# Altium project Bus_Adaptor_Hw.PrjPcb
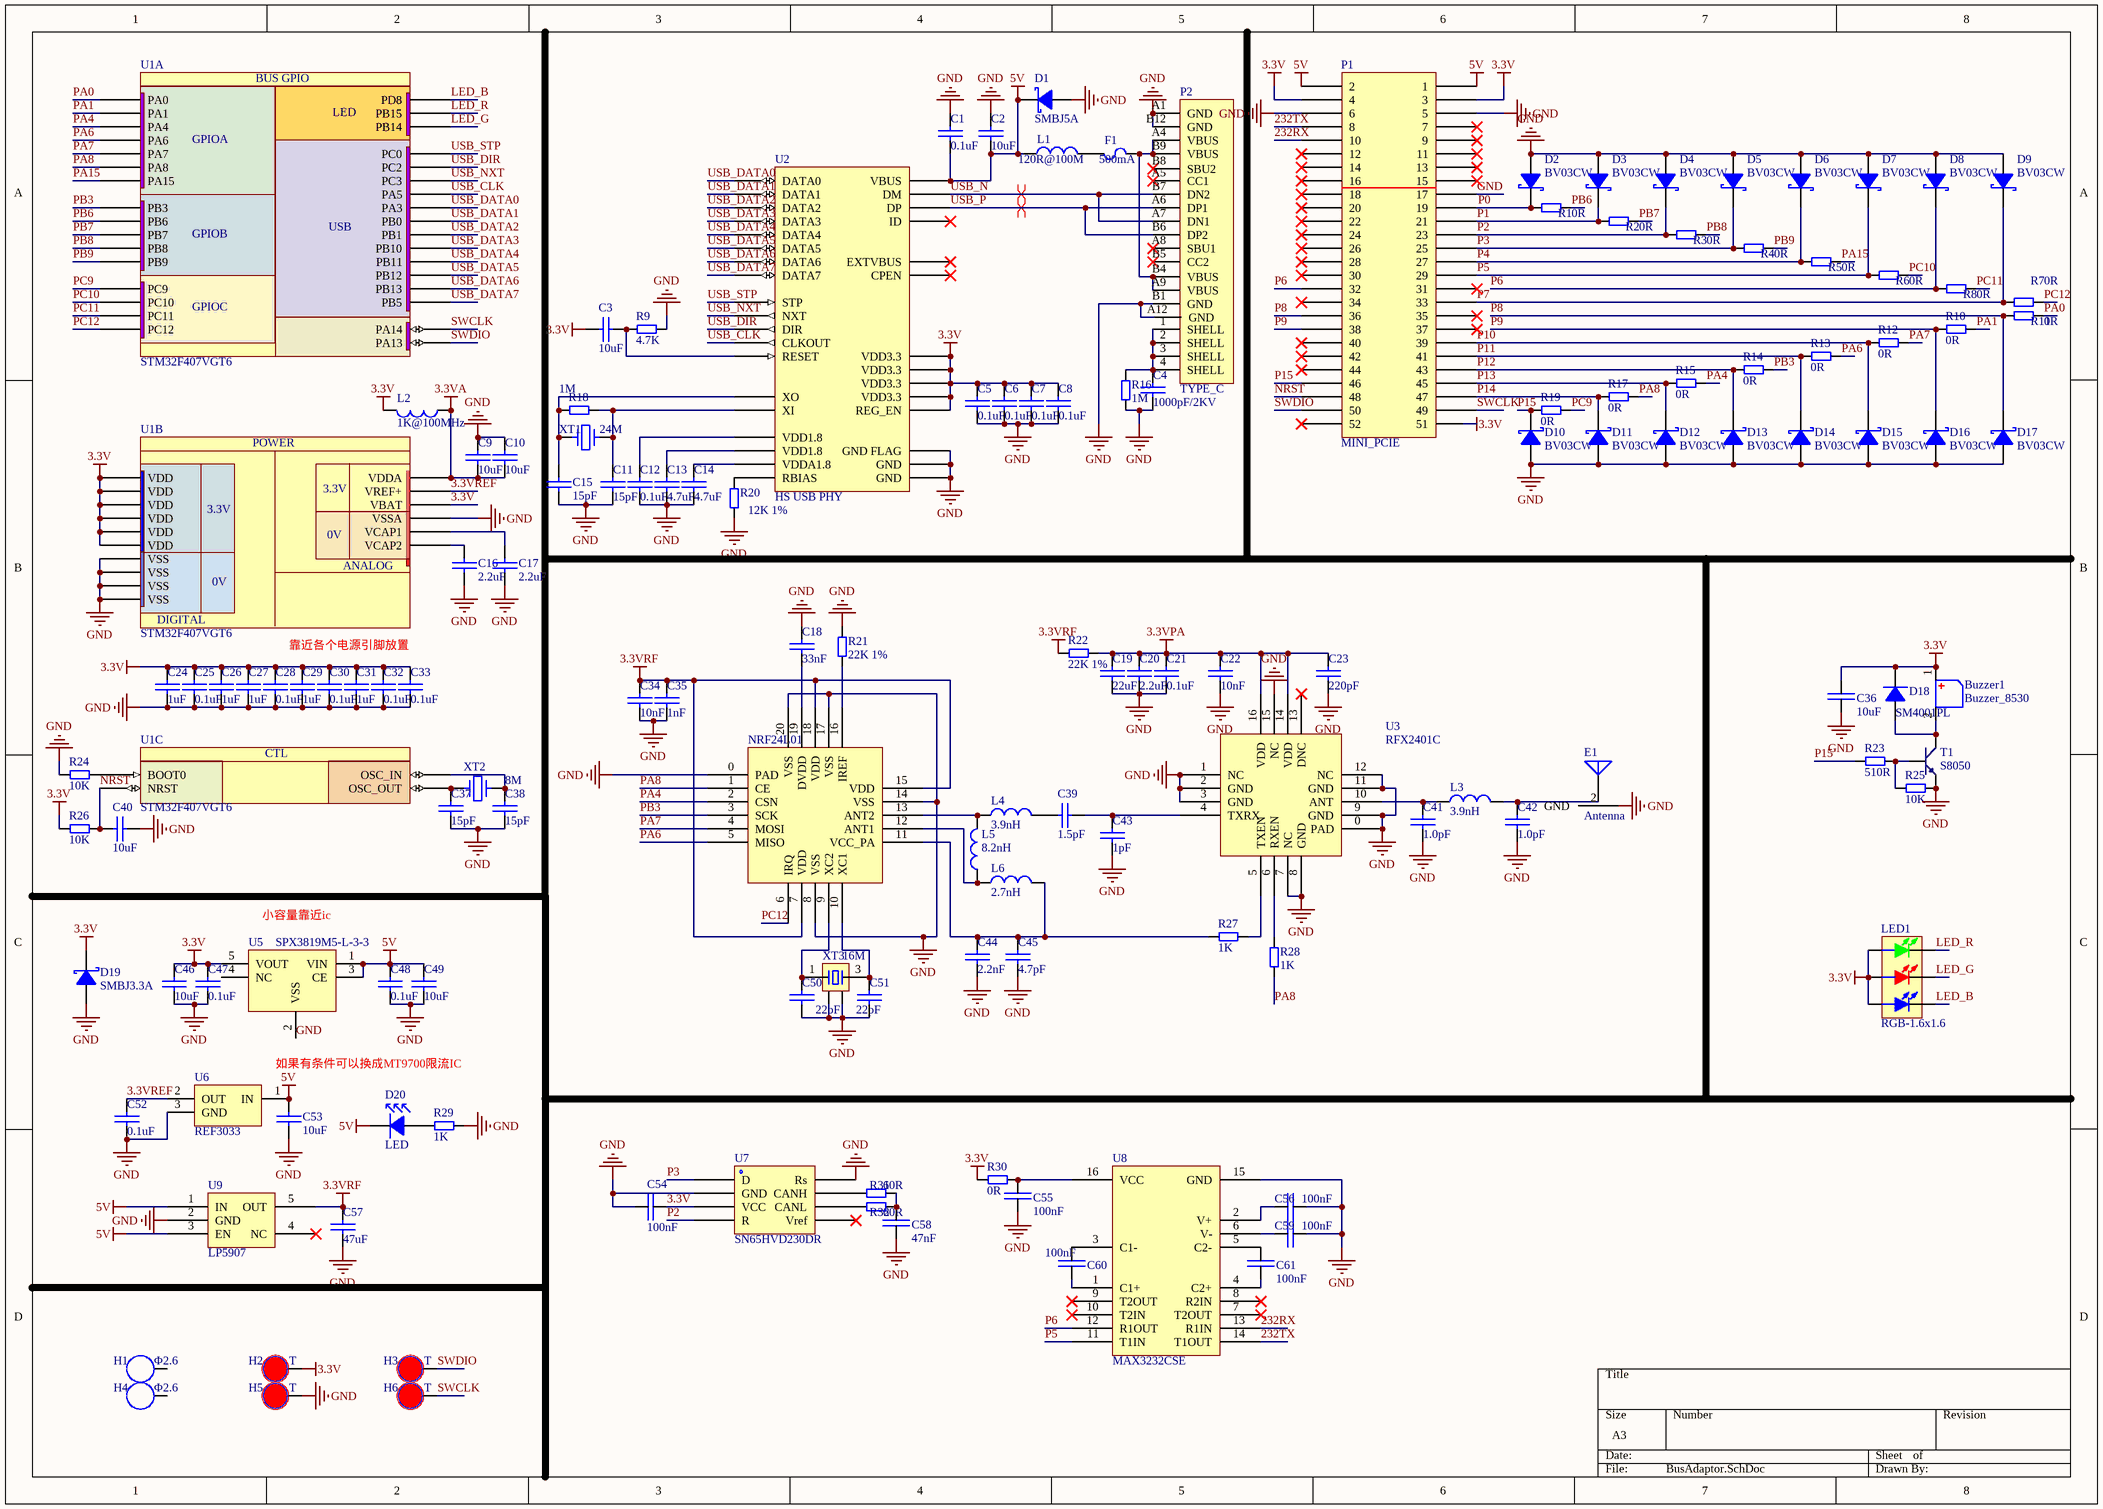
[diagram p0: BusAdaptor.SchDoc]
1 sheet, 144 parts. Net scope: global (net labels, ports and power ports of the same name join across sheets).
Board file: BusAdaptor_final.PcbDoc

## Sheet BusAdaptor.SchDoc
size A3

### Parts
Buzzer1  Buzzer_8530  [BUZZER_8530]
C1  0.1uF  [0201]
C2  10uF  [0402_C]
C3  10uF  [0402_C]
C4  1000pF/2KV  [1206_C]
C5  0.1uF  [0201]
C6  0.1uF  [0201]
C7  0.1uF  [0201]
C8  0.1uF  [0201]
C9  10uF  [0402_C]
C10  10uF  [0402_C]
C11  15pF  [0201]
C12  0.1uF  [0201]
C13  4.7uF  [0402_C]
C14  4.7uF  [0402_C]
C15  15pF  [0201]
C16  2.2uF  [0402_C]
C17  2.2uF  [0402_C]
C18  33nF  [0402_C]
C19  22uF  [0603_C]
C20  2.2uF  [0402_C]
C21  0.1uF  [0402_C]
C22  10nF  [0402_C]
C23  220pF  [0402_C]
C24  1uF  [0201]
C25  0.1uF  [0201]
C26  1uF  [0201]
C27  1uF  [0201]
C28  0.1uF  [0201]
C29  1uF  [0201]
C30  0.1uF  [0201]
C31  1uF  [0201]
C32  0.1uF  [0201]
C33  0.1uF  [0201]
C34  10nF  [0402_C]
C35  1nF  [0402_C]
C36  10uF  [0402_C]
C37  15pF  [0402_C]
C38  15pF  [0402_C]
C39  1.5pF  [0402_C]
C40  10uF  [0402_C]
C41  1.0pF  [0402_C]
C42  1.0pF  [0402_C]
C43  1pF  [0402_C]
C44  2.2nF  [0402_C]
C45  4.7pF  [0402_C]
C46  10uF  [0402_C]
C47  0.1uF  [0402_C]
C48  0.1uF  [0402_C]
C49  10uF  [0402_C]
C50  22pF  [0402_C]
C51  22pF  [0402_C]
C52  0.1uF  [0402_C]
C53  10uF  [0402_C]
C54  100nF  [0402_C]
C55  100nF  [0201]
C56  100nF  [0201]
C57  47uF  [0805_C]
C58  47nF  [0402_C]
C59  100nF  [0201]
C60  100nF  [0201]
C61  100nF  [0201]
D1  SMBJ5A  [SMB]
D2  BV03CW  [SOD323]
D3  BV03CW  [SOD323]
D4  BV03CW  [SOD323]
D5  BV03CW  [SOD323]
D6  BV03CW  [SOD323]
D7  BV03CW  [SOD323]
D8  BV03CW  [SOD323]
D9  BV03CW  [SOD323]
D10  BV03CW  [SOD323]
D11  BV03CW  [SOD323]
D12  BV03CW  [SOD323]
D13  BV03CW  [SOD323]
D14  BV03CW  [SOD323]
D15  BV03CW  [SOD323]
D16  BV03CW  [SOD323]
D17  BV03CW  [SOD323]
D18  SM4001PL  [SOD-123FL]
D19  SMBJ3.3A  [SMB]
D20  LED  [0603_L]
E1  Antenna  [IPEX]
F1  500mA  [0805_R]
H1  Φ2.6  [HOLD]
H2  T  [testpoint]
H3  T  [testpoint]
H4  Φ2.6  [HOLD]
H5  T  [testpoint]
H6  T  [testpoint]
L1  120R@100M  [0603_L]
L2  1K@100MHz  [0603_L]
L3  3.9nH  [0402_L]
L4  3.9nH  [0402_L]
L5  8.2nH  [0402_L]
L6  2.7nH  [0402_L]
LED1  RGB-1.6x1.6  [RGB-1.6x1.6]
NRF24L01  NRF24L01  [QFN-20_4x4x05P]  (value not drawn)
P1  MINI_PCIE  [MINIPCIE]
P2  TYPE_C  [TYPE-C-TOP]
R1  0R  [0402_R]
R2  0R  [0402_R]
R3  0R  [0402_R]
R4  0R  [0402_R]
R5  0R  [0402_R]
R6  0R  [0402_R]
R7  0R  [0402_R]
R8  0R  [0402_R]
R9  4.7K  [0402_R]
R10  0R  [0402_R]
R11  0R  [0402_R]
R12  0R  [0402_R]
R13  0R  [0402_R]
R14  0R  [0402_R]
R15  0R  [0402_R]
R16  1M  [0201]
R17  0R  [0402_R]
R18  1M  [0201]
R19  0R  [0402_R]
R20  12K 1%  [0402_R]
R21  22K 1%  [0402_R]
R22  22K 1%  [0402_R]
R23  510R  [0402_R]
R24  10K  [0402_R]
R25  10K  [0402_R]
R26  10K  [0402_R]
R27  1K  [0402_R]
R28  1K  [0402_R]
R29  1K  [0402_R]
R30  0R  [0201]
R31  60R  [0402_R]
R32  60R  [0402_R]
T1  S8050  [SOT-23(SOT-23-3)]
U1  STM32F407VGT6  [TQFP-100]  (parts A,B,C of 3)
U2  HS USB PHY  [QFN50P500X500X100-32N]
U3  RFX2401C  [RFX2401C]
U5  SPX3819M5-L-3-3  [SOT-23-5]
U6  REF3033  [SOT-23(SOT-23-3)]
U7  SN65HVD230DR
U8  MAX3232CSE  [SOIC-16_150mil]
U9  LP5907  [SOT-23-5]
XT1  24M  [CRYSTAL-SMD-5032]
XT2  8M  [CRYSTAL-SMD-5032]
XT3  16M  [OSC 3225-4P]

### Nets
3.3V: Buzzer1.1 C3.2 C5.2 C6.2 C7.2 C8.2 C24.2 C25.2 C26.2 C27.2 C28.2 C29.2 C30.2 C31.2 C32.2 C33.2 C36.2 C46.2 C47.2 C54.1 D18.2(K) D19.2(K) H2.1 L2.2 LED1.2(A) LED1.4(A) LED1.6(A) P1.3 P1.4 P1.51 R26.1 R30.2 U1.6(VBAT) U1.11(VDD) U1.19(VDD) U1.28(VDD) U1.50(VDD) U1.75(VDD) U1.100(VDD) U2.6(VDD3.3) U2.16(VDD3.3) U2.25(VDD3.3) U2.30(VDD3.3) U2.31(REG_EN) U5.5(VOUT) U7.3(VCC)
3.3VA: C9.1 C10.1 L2.1 U1.22(VDDA)
3.3VPA: C19.2 C20.2 C21.2 C22.2 C23.2 R22.1 U3.14(VDD) U3.16(VDD)
3.3VRF: C34.2 C35.2 C57.2 NRF24L01.7(VDD) NRF24L01.15(VDD) NRF24L01.18(VDD) R22.2 U9.5(OUT)
5V: C1.1 C2.1 C48.2 C49.2 C53.2 D1.2(K) D20.2(K) L1.1 P1.1 P1.2 U2.4(VBUS) U5.1(VIN) U5.3(CE) U6.1(IN) U9.1(IN) U9.3(EN)
GND: C1.2 C2.2 C4.1 C5.1 C6.1 C7.1 C8.1 C9.2 C10.2 C11.1 C12.1 C13.1 C14.1 C15.1 C16.1 C17.1 C18.2 C19.1 C20.1 C21.1 C22.1 C23.1 C24.1 C25.1 C26.1 C27.1 C28.1 C29.1 C30.1 C31.1 C32.1 C33.1 C34.1 C35.1 C36.1 C37.1 C38.1 C40.1 C41.1 C42.1 C43.1 C44.1 C45.1 C46.1 C47.1 C48.1 C49.1 C50.1 C51.1 C52.1 C53.1 C54.2 C55.2 C56.2 C57.1 C58.1 C59.2 D1.1(A) D2.1(A) D3.1(A) D4.1(A) D5.1(A) D6.1(A) D7.1(A) D8.1(A) D9.1(A) D10.1(A) D11.1(A) D12.1(A) D13.1(A) D14.1(A) D15.1(A) D16.1(A) D17.1(A) D19.1(A) E1.2(GND) H5.1 NRF24L01.0(PAD) NRF24L01.8(VSS) NRF24L01.14(VSS) NRF24L01.17(VSS) NRF24L01.20(VSS) P1.5 P1.6 P1.17 P2.A1(GND) P2.A12(GND) P2.B1(GND) P2.B12(GND) R9.2 R16.1 R20.1 R21.2 R24.1 R25.2 R29.1 T1.2(E) U1.10(VSS) U1.20(VSSA) U1.27(VSS) U1.74(VSS) U1.99(VSS) U2.0(GND_FLAG) U2.1(GND) U2.2(GND) U3.0(PAD) U3.1(NC) U3.2(GND) U3.3(GND) U3.7(NC) U3.8(GND) U3.9(GND) U3.11(GND) U3.12(NC) U3.15(NC) U5.2(VSS) U6.3(GND) U7.2(GND) U7.8(Rs) U8.15(GND) U9.2(GND) XT3.2 XT3.4
3.3VREF: C52.2 U1.21(VREF+) U6.2(OUT)
232RX: P1.10 U8.13(R1IN)
232TX: P1.8 U8.14(T1OUT)
LED_B: LED1.5(BULE_K) U1.55(PD8)
LED_G: LED1.3(RED_K) U1.53(PB14)
LED_R: LED1.1(GREEN_K) U1.54(PB15)
NRST: C40.2 P1.48 R26.2 U1.14(NRST)
P0: D2.2(K) P1.19 R1.1
P1: D3.2(K) P1.21 R2.1
P2: D4.2(K) P1.23 R3.1 U7.4(R)
P3: D5.2(K) P1.25 R4.1 U7.1(D)
P4: D6.2(K) P1.27 R5.1
P5: D7.2(K) P1.29 R6.1 U8.11(T1IN)
P6: D8.2(K) P1.32 R8.1 U8.12(R1OUT)
P7: D9.2(K) P1.33 R7.1
P8: D17.2(K) P1.36 R11.1
P9: D16.2(K) P1.38 R10.1
P10: D15.2(K) P1.39 R12.1
P11: D14.2(K) P1.41 R13.1
P12: D13.2(K) P1.43 R14.1
P13: D12.2(K) P1.45 R15.1
P14: D11.2(K) P1.47 R17.1
P15: D10.2(K) P1.46 R19.1 R23.1
PA0: R11.2 U1.23(PA0)
PA1: R10.2 U1.24(PA1)
PA4: NRF24L01.2(CSN) R15.2 U1.29(PA4)
PA6: NRF24L01.5(MISO) R13.2 U1.31(PA6)
PA7: NRF24L01.4(MOSI) R12.2 U1.32(PA7)
PA8: NRF24L01.1(CE) R17.2 R28.1 U1.67(PA8)
PA15: R5.2 U1.77(PA15)
PB3: NRF24L01.3(SCK) R14.2 U1.89(PB3)
PB6: R1.2 U1.92(PB6)
PB7: R2.2 U1.93(PB7)
PB8: R3.2 U1.95(PB8)
PB9: R4.2 U1.96(PB9)
PC9: R19.2 U1.66(PC9)
PC10: R6.2 U1.78(PC10)
PC11: R8.2 U1.79(PC11)
PC12: NRF24L01.6(IRQ) R7.2 U1.80(PC12)
SWCLK: H6.1 P1.49 U1.76(PA14)
SWDIO: H3.1 P1.50 U1.72(PA13)
USB_CLK: U1.30(PA5) U2.14(CLKOUT)
USB_DATA0: U1.26(PA3) U2.24(DATA0)
USB_DATA1: U1.35(PB0) U2.23(DATA1)
USB_DATA2: U1.36(PB1) U2.22(DATA2)
USB_DATA3: U1.47(PB10) U2.21(DATA3)
USB_DATA4: U1.48(PB11) U2.20(DATA4)
USB_DATA5: U1.51(PB12) U2.19(DATA5)
USB_DATA6: U1.52(PB13) U2.18(DATA6)
USB_DATA7: U1.91(PB5) U2.17(DATA7)
USB_DIR: U1.17(PC2) U2.12(DIR)
USB_N: P2.A7(DN1) P2.B7(DN2) U2.8(DM)
USB_NXT: U1.18(PC3) U2.11(NXT)
USB_P: P2.A6(DP1) P2.B6(DP2) U2.7(DP)
USB_STP: U1.15(PC0) U2.13(STP)
NetBuzzer1_2: Buzzer1.2 D18.1(A) T1.3(C)
NetC3_1: C3.1 R9.1 U2.9(RESET)
NetC4_2: C4.2 P2.1(SHELL) P2.2(SHELL) P2.3(SHELL) P2.4(SHELL) R16.2
NetC11_2: C11.2 R18.2 U2.28(XI) XT1.2
NetC12_2: C12.2 U2.15(VDD1.8)
NetC13_2: C13.2 U2.26(VDD1.8)
NetC14_2: C14.2 U2.29(VDDA1.8)
NetC15_2: C15.2 R18.1 U2.27(XO) XT1.1
NetC16_2: C16.2 U1.73(VCAP2)
NetC17_2: C17.2 U1.49(VCAP1)
NetC18_1: C18.1 NRF24L01.19(DVDD)
NetC37_2: C37.2 U1.13(OSC_OUT) XT2.1
NetC38_2: C38.2 U1.12(OSC_IN) XT2.2
NetC39_1: C39.1 C43.2 U3.4(TXRX)
NetC39_2: C39.2 L4.2
NetC41_2: C41.2 L3.1 U3.10(ANT)
NetC42_2: C42.2 E1.1(ANT) L3.2
NetC44_2: C44.2 C45.2 L6.2 NRF24L01.11(VCC_PA) R27.2
NetC50_2: C50.2 NRF24L01.9(XC2) XT3.1
NetC51_2: C51.2 NRF24L01.10(XC1) XT3.3
NetC55_1: C55.1 R30.1 U8.16(VCC)
NetC56_1: C56.1 U8.2(V+)
NetC58_2: C58.2 R31.1 R32.1
NetC59_1: C59.1 U8.6(V-)
NetC60_1: C60.1 U8.3(C1-)
NetC60_2: C60.2 U8.1(C1+)
NetC61_1: C61.1 U8.5(C2-)
NetC61_2: C61.2 U8.4(C2+)
NetD20_1: D20.1(A) R29.2
NetF1_1: F1.1 L1.2
NetF1_2: F1.2 P2.A4(VBUS) P2.A9(VBUS) P2.B4(VBUS) P2.B9(VBUS)
NetL4_1: L4.1 L5.2 NRF24L01.13(ANT2)
NetL5_1: L5.1 L6.1 NRF24L01.12(ANT1)
NetNRF24L01_16: NRF24L01.16(IREF) R21.1
NetR20_2: R20.2 U2.32(RBIAS)
NetR23_2: R23.2 R25.1 T1.1(B)
NetR24_2: R24.2 U1.94(BOOT0)
NetR27_1: R27.1 U3.5(TXEN)
NetR28_2: R28.2 U3.6(RXEN)
NetR31_2: R31.2 U7.7(CANH)
NetR32_2: R32.2 U7.6(CANL)

Not connected (* = marked no-connect by the designer): H1 1; H4 1; P1 7* 9* 11* 12* 13* 14* 15* 16* 18* 20* 22* 24* 26* 28* 30* 31* 34* 35* 37* 40* 42* 44* 52*; P2 A5(CC1)* A8(SBU1)* B5(CC2)* B8(SBU2)*; U2 3(CPEN)* 5(ID)* 10(EXTVBUS)*; U3 13(DNC)*; U5 4(NC); U7 5(Vref)*; U8 7(T2OUT)* 8(R2IN)* 9(T2OUT)* 10(T2IN)*; U9 4(NC)*

### Layout directives
differential pair: USB_N, USB_P

### Notes on the sheet
- 靠近各个电源引脚放置
- (near U5) 小容量靠近ic
- 如果有条件可以换成MT9700限流IC
- (in symbol STM32F407VGT6, part A) BUS GPIO; LED; GPIOA; USB; GPIOB; GPIOC
- (in symbol STM32F407VGT6, part B) POWER; 3.3V; 0V; ANALOG; DIGITAL
- (in symbol STM32F407VGT6, part C) CTL

### Library data of the parts
Buzzer1 = Buzzer_8530: 无源蜂鸣器
C1-C61 = C
D1 D19 = TVS: BV03CW
D2-D17 = TVS
D18 = Diode: 二极管; 备注: 1N4007 4007 编号C2464 已经停售, 使用新物料编号C95872; ComponentLink1Description: 供应商链接; ComponentLink1URL: http://www.szlcsc.com/product/details_2841.html; Package: SMA(DO-214AC); Supplier: LC; SuppliersPartNumber: C95872
E1 = Antenna: Generic Antenna; Published: 24-Mar-1999; LatestRevisionDate: 17-Jul-2002; LatestRevisionNote: Re-released for DXP Platform.; PackageReference: PIN1; Publisher: Altium Limited
F1 = FUSE
H1 H4 = MECHANICAL
H2 H3 H5 H6 = TEST_POINT
L1-L6 = L
LED1 = LED-RGB 3528: 3528三基色LED
P2 = USB_C
R1-R32 = R: resistor
T1 = Triode: NPN
U1 = STM32F407VGT6: ARM Cortex-M4 32b MCU+FPU, 1024 kB Flash, 192+4 kB RAM,82 I/Os, 100-pin LQFP; Internal RAM: 192kB; Operating Frequency (Processor Speed): 168MHz; A/D Converter: 16x12-bit; D/A Converter: 2x12-bit; 16-bit Timers (IC/OC/PWM): 12x16-bit(24/24/30); 32-bit Timer (IC/OC/PWM): 2x32-bit (8/8/8); Other Timer Functions: 2xWDG, RTC, 24-bit down counter; Serial Interface: 3xSPI/2xI2S/2xI2C/3xUSART(IrDa, ISO7816)/3xUART/2xUSB OTG FS/HS, 2xCAN/Ethernet MAC10/100, SDIO; DatasheetVersion: rev2, Jan-2012; PackageVersion: 2012; PackageReference: LQFP100; PackageDescription: 100-Pin Low Profile Quad Flat Package, 14x14 mm Body, 0.5 mm Pitch; ComponentLink1Description: Manufacturer URL; ComponentLink1URL: http://www.st.com/; ComponentLink2Description: STM32F405/7 Datasheet; ComponentLink2URL: http://www.st.com/internet/com/TECHNICAL_RESOURCES/TECHNICAL_LITERATURE/DATASHEET/DM00037051.pdf; ComponentLink3Description: STM32F4 Web Page; ComponentLink3URL: http://www.st.com/internet/mcu/subclass/1521.jsp
U2 = USB3300: 高速USB外置PHY
U5 = ME6211
U6 = REF3033: REF3033电压参考源
U8 = RS3232
XT1 XT2 = XTAL: 晶振
XT3 = XTAL-4P: 4脚无源晶振